# Altium schematic sheet raspberry_connector.SchDoc: DevelBoard EVA Main Connectors
size A3; Author: Daniele Basile <asterix@develer.com>; Organization: Develer s.r.l.; Address1: via Mugellese 1/A; Address2: 50019 Campi Bisenzio; Address3: Firenze; Address4: ITALY; DocumentNumber: 1; Revision: EVA 0; SheetNumber: 1; SheetTotal: 3
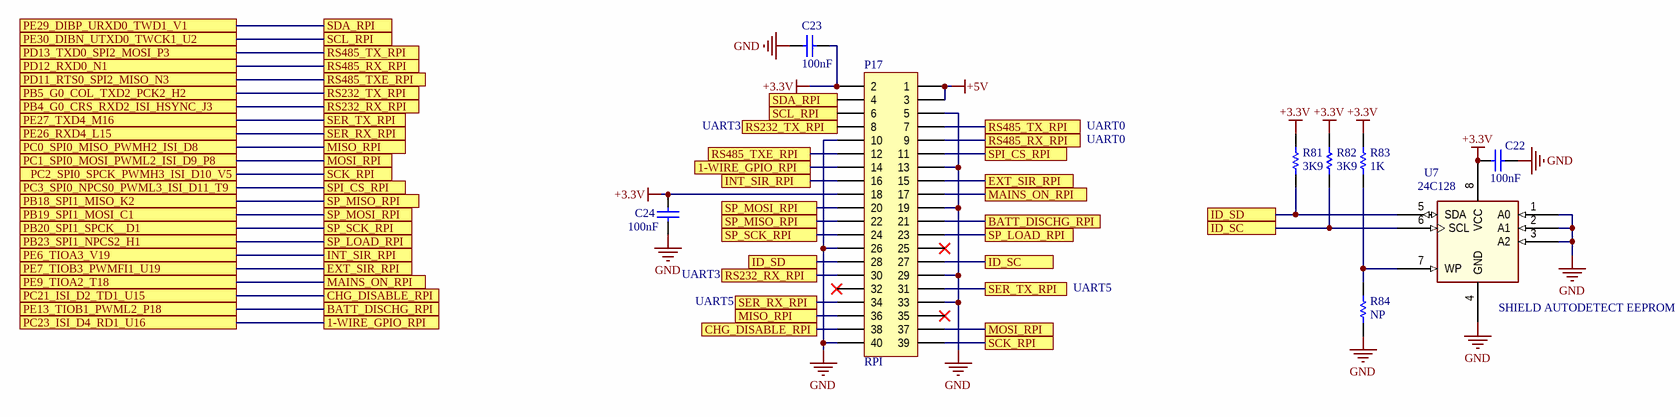
[diagram p0: raspberry_connector.SchDoc]

## Parts
C22  100nF  [0603_[1608]]
C23  100nF  [0603_[1608]]
C24  100nF  [0603_[1608]]
P17  RPI  [SOCKET_2x20_2.54MM_THD]
R81  3K9  [0603_[1608]]
R82  3K9  [0603_[1608]]
R83  1K  [0603_[1608]]
R84  NP  [0603_[1608]]
U7  24C128  [SOIC8]

## Ports
1-WIRE_GPIO_RPI, BATT_DISCHG_RPI, CHG_DISABLE_RPI, EXT_SIR_RPI, ID_SC, ID_SD, INT_SIR_RPI, MAINS_ON_RPI, MISO_RPI, MOSI_RPI, PB4_G0_CRS_RXD2_ISI_HSYNC_J3, PB5_G0_COL_TXD2_PCK2_H2, PB18_SPI1_MISO_K2, PB19_SPI1_MOSI_C1, PB20_SPI1_SPCK__D1, PB23_SPI1_NPCS2_H1, PC0_SPI0_MISO_PWMH2_ISI_D8, PC1_SPI0_MOSI_PWML2_ISI_D9_P8, PC2_SPI0_SPCK_PWMH3_ISI_D10_V5, PC3_SPI0_NPCS0_PWML3_ISI_D11_T9, PC21_ISI_D2_TD1_U15, PC23_ISI_D4_RD1_U16, PD11_RTS0_SPI2_MISO_N3, PD12_RXD0_N1, PD13_TXD0_SPI2_MOSI_P3, PE6_TIOA3_V19, PE7_TIOB3_PWMFI1_U19, PE9_TIOA2_T18, PE13_TIOB1_PWML2_P18, PE26_RXD4_L15, PE27_TXD4_M16, PE29_DIBP_URXD0_TWD1_V1, PE30_DIBN_UTXD0_TWCK1_U2, RS232_RX_RPI, RS232_TX_RPI, RS485_RX_RPI, RS485_TX_RPI, RS485_TXE_RPI, SCK_RPI, SCL_RPI, SDA_RPI, SER_RX_RPI, SER_TX_RPI, SP_LOAD_RPI, SP_MISO_RPI, SP_MOSI_RPI, SP_SCK_RPI, SPI_CS_RPI

## Nets
+3.3V: C22.2 C23.2 C24.1 P17.2 P17.18 R81.2 R82.2 R83.2 U7.8(VCC)
+5V: P17.1 P17.3
GND: C22.1 C23.1 C24.2 P17.5 P17.10 P17.13 P17.19 P17.26 P17.29 P17.33 P17.40 R84.1 U7.1(A0) U7.2(A1) U7.3(A2) U7.4(GND)
1-WIRE_GPIO_RPI: P17.14 ; port 1-WIRE_GPIO_RPI, port PC23_ISI_D4_RD1_U16
BATT_DISCHG_RPI: P17.21 ; port BATT_DISCHG_RPI, port PE13_TIOB1_PWML2_P18
CHG_DISABLE_RPI: P17.38 ; port CHG_DISABLE_RPI, port PC21_ISI_D2_TD1_U15
EXT_SIR_RPI: P17.15 ; port EXT_SIR_RPI, port PE7_TIOB3_PWMFI1_U19
ID_SC: P17.27 R82.1 U7.6(SCL) ; port ID_SC
ID_SD: P17.28 R81.1 U7.5(SDA) ; port ID_SD
INT_SIR_RPI: P17.16 ; port INT_SIR_RPI, port PE6_TIOA3_V19
MAINS_ON_RPI: P17.17 ; port MAINS_ON_RPI, port PE9_TIOA2_T18
MISO_RPI: P17.36 ; port MISO_RPI, port PC0_SPI0_MISO_PWMH2_ISI_D8
MOSI_RPI: P17.37 ; port MOSI_RPI, port PC1_SPI0_MOSI_PWML2_ISI_D9_P8
PB4_G0_CRS_RXD2_ISI_HSYNC_J3: P17.30 ; port RS232_RX_RPI, port PB4_G0_CRS_RXD2_ISI_HSYNC_J3
PB5_G0_COL_TXD2_PCK2_H2: P17.8 ; port RS232_TX_RPI, port PB5_G0_COL_TXD2_PCK2_H2
PB18_SPI1_MISO_K2: P17.22 ; port SP_MISO_RPI, port PB18_SPI1_MISO_K2
PB19_SPI1_MOSI_C1: P17.20 ; port SP_MOSI_RPI, port PB19_SPI1_MOSI_C1
PB20_SPI1_SPCK__D1: P17.24 ; port SP_SCK_RPI, port PB20_SPI1_SPCK__D1
PB23_SPI1_NPCS2_H1: P17.23 ; port SP_LOAD_RPI, port PB23_SPI1_NPCS2_H1
PC2_SPI0_SPCK_PWMH3_ISI_D10_V5: P17.39 ; port SCK_RPI, port PC2_SPI0_SPCK_PWMH3_ISI_D10_V5
PC3_SPI0_NPCS0_PWML3_ISI_D11_T9: P17.11 ; port SPI_CS_RPI, port PC3_SPI0_NPCS0_PWML3_ISI_D11_T9
PD11_RTS0_SPI2_MISO_N3: P17.12 ; port RS485_TXE_RPI, port PD11_RTS0_SPI2_MISO_N3
PD12_RXD0_N1: P17.9 ; port RS485_RX_RPI, port PD12_RXD0_N1
PD13_TXD0_SPI2_MOSI_P3: P17.7 ; port RS485_TX_RPI, port PD13_TXD0_SPI2_MOSI_P3
PE26_RXD4_L15: P17.34 ; port SER_RX_RPI, port PE26_RXD4_L15
PE27_TXD4_M16: P17.31 ; port SER_TX_RPI, port PE27_TXD4_M16
PE29_DIBP_URXD0_TWD1_V1: P17.4 ; port SDA_RPI, port PE29_DIBP_URXD0_TWD1_V1
PE30_DIBN_UTXD0_TWCK1_U2: P17.6 ; port SCL_RPI, port PE30_DIBN_UTXD0_TWCK1_U2
NetR83_1: R83.1 R84.2 U7.7(WP)

Not connected (* = marked no-connect by the designer): P17 25* 32* 35*

## Notes on the sheet
- UART3
- UART0
- (near C24) UART3
- UART5
- (near U7) SHIELD AUTODETECT EEPROM
- Title:
- Author:
- License:
- BSD
- Rev:
- Size:
- A3
- File:
- Date:
- Time:
- Sheet
- of

## Library data of the parts
C22-C24 = Cap: Ceramic X7R 50V; Value: 10nF; Published: 8-Jun-2000; Revision: July-2002: Re-released for DXP Platform.; Publisher: Altium Limited
P17 = Header 20X2: Header, 20-Pin, Dual row; LatestRevisionDate: 17-Jul-2002; LatestRevisionNote: Re-released for DXP Platform.; Publisher: Altium Limited
R81-R84 = Res1: Resistor; Revision: July-2002: Re-released for DXP Platform.
U7 = EEPROM-SOIC8: EEPROM